# EAGLE design POE_PD_4_P-Schalter_minimized2 (EAGLE 6.5.0)
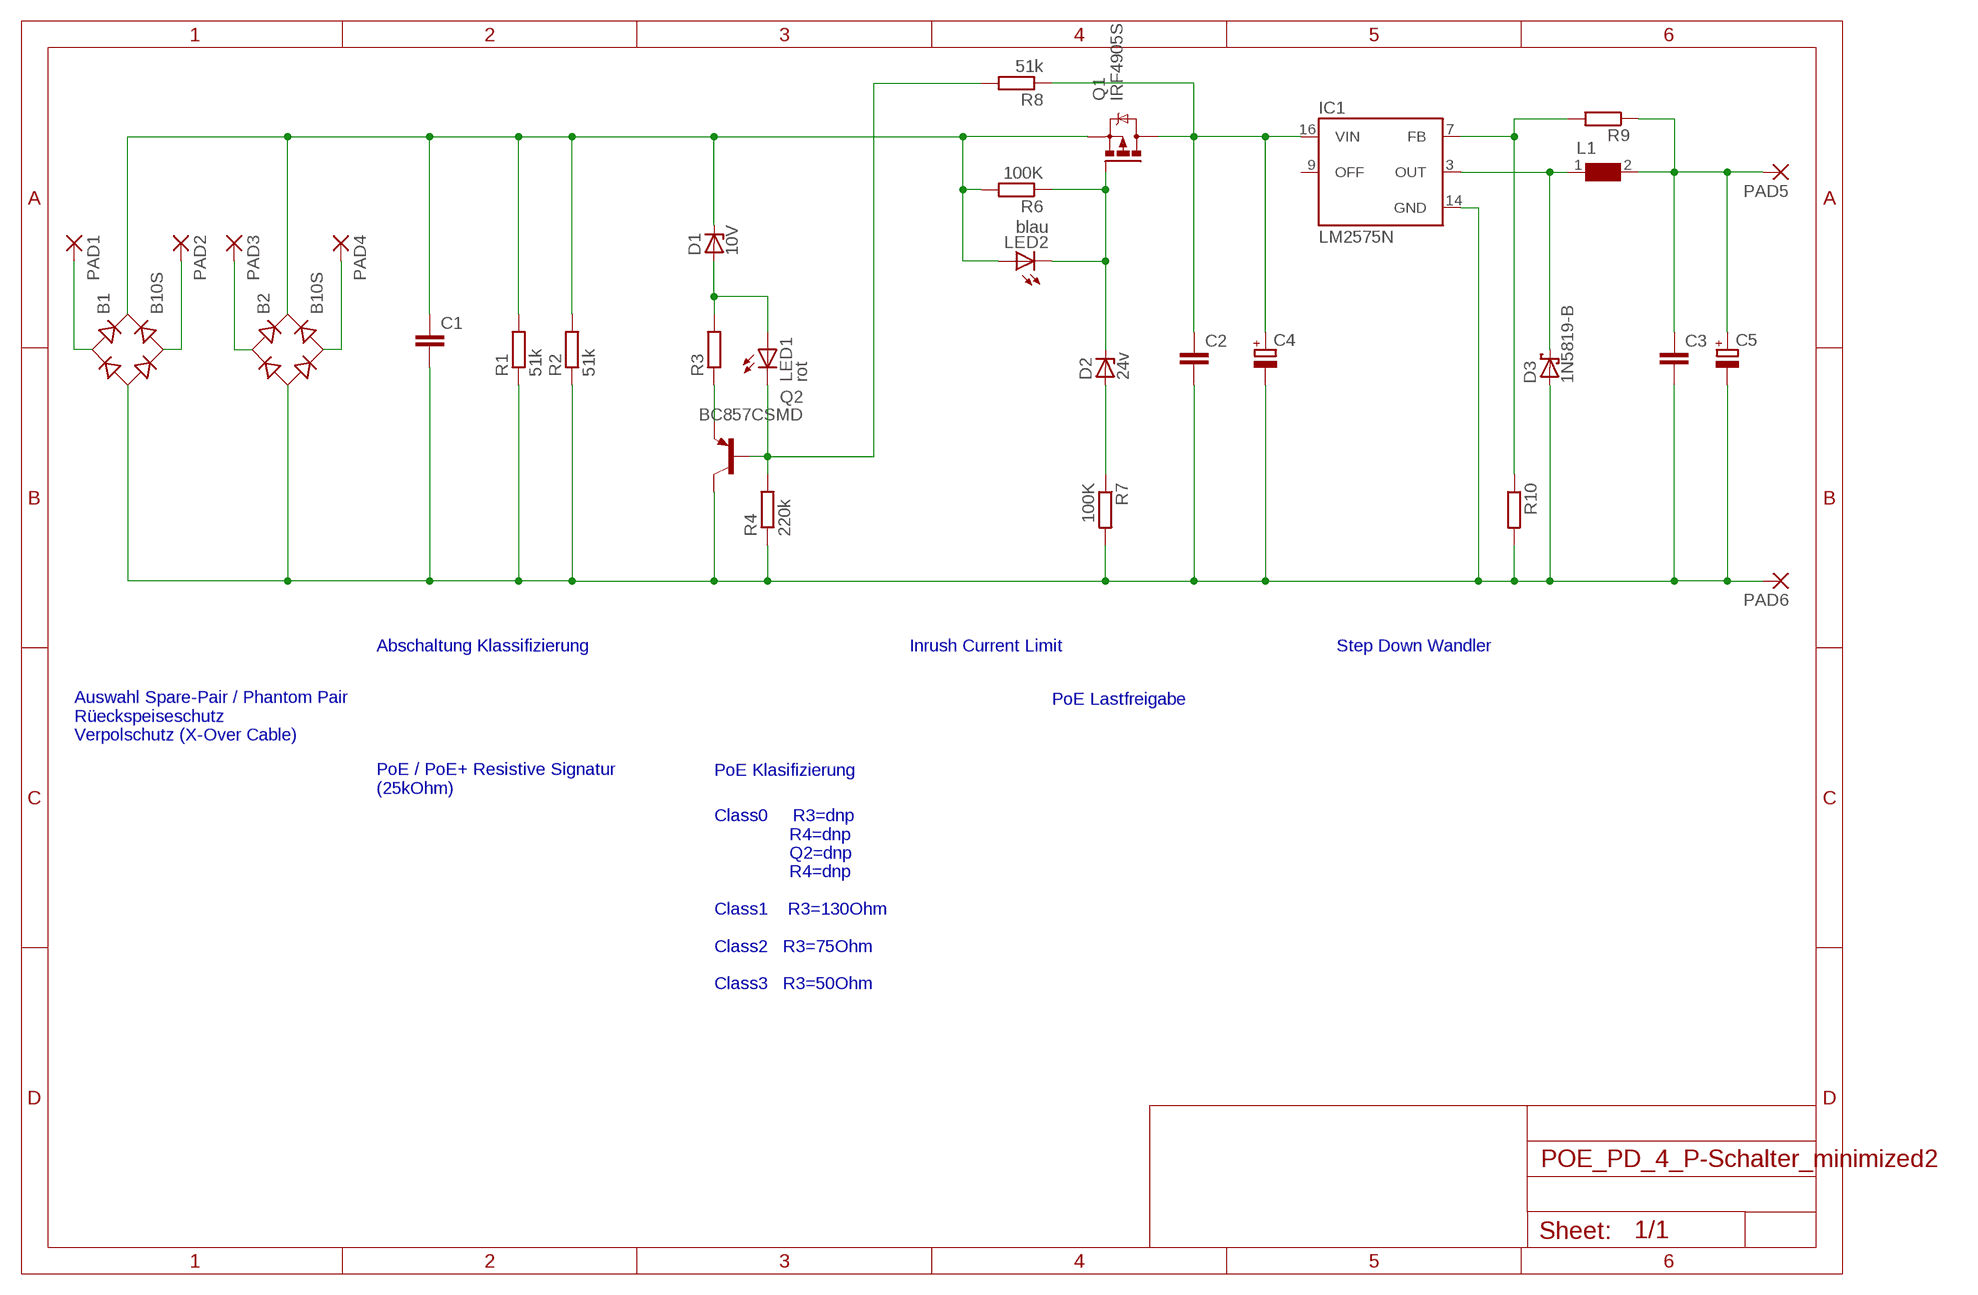
[diagram p0: schematic, sheet 1]

## Parts
B1  B10S  [MBS]
B2  B10S  [MBS]
C1  C-EUC0805  [C0805]
C2  C-EUC0805  [C0805]
C3  C-EUC0805  [C0805]
C4  CPOL-EUE2.5-5  [E2,5-5]
C5  CPOL-EUE2.5-5  [E2,5-5]
D1  10V  ZENER-DIODESOT23  [SOT23]
D2  24v  ZENER-DIODESOT23  [SOT23]
D3  1N5819-B  [DO41-7.6]
IC1  LM2575N  [DIL16]
L1  WE-PD2_S  [WE-PD2_S]
LED1  rot  LEDCHIP-LED0805  [CHIP-LED0805]
LED2  blau  LEDCHIP-LED0805  [CHIP-LED0805]
PAD1  2,15/1,0  [2,15/1,0]
PAD2  2,15/1,0  [2,15/1,0]
PAD3  2,15/1,0  [2,15/1,0]
PAD4  2,15/1,0  [2,15/1,0]
PAD5  2,15/1,0  [2,15/1,0]
PAD6  2,15/1,0  [2,15/1,0]
Q1  IRF4905S  IRFR5305  [D-PAK_TO252AA]
Q2  BC857CSMD  [SOT23-BEC]
R1  51k  R-EU_R0603  [R0603]
R2  51k  R-EU_R0603  [R0603]
R3  R-EU_0207/7  [0207/7]
R4  220k  R-EU_R0603  [R0603]
R6  100K  R-EU_R0603  [R0603]
R7  100K  R-EU_R0603  [R0603]
R8  51k  R-EU_R0603  [R0603]
R9  R-EU_0207/7  [0207/7]
R10  R-EU_0207/7  [0207/7]

## Nets
N$1: B1.- B2.- C1.2 C2.2 C3.2 C4.- C5.- D3.A IC1.14(GND) PAD6.1(P) Q2.C R1.1 R2.1 R4.1 R7.2 R10.2
N$4: Q2.E R3.1
N$5: B1.AC1 PAD1.1(P)
N$6: LED1.C Q2.B R4.2 R8.2
N$8: D1.1(A) LED1.A R3.2
N$9: D2.1(A) R7.1
N$10: B1.+ B2.+ C1.1 D1.3(C) LED2.A Q1.3(S) R1.2 R2.2 R6.2
N$11: D2.3(C) LED2.C Q1.1(G) R6.1
N$12: D3.C IC1.3(OUT) L1.1
N$13: C3.1 C5.+ L1.2 PAD5.1(P) R9.1
N$14: C2.1 C4.+ IC1.16(VIN) Q1.4(D) R8.1
N$15: IC1.7(FB) R9.2 R10.1
N$16: B1.AC2 PAD2.1(P)
N$17: B2.AC1 PAD3.1(P)
N$18: B2.AC2 PAD4.1(P)
Unconnected: IC1.9(OFF)

## Notes on the sheet
- Abschaltung Klassifizierung | Inrush Current Limit | Step Down Wandler
- PoE Lastfreigabe
- Auswahl Spare-Pair / Phantom Pair
  Rüeckspeiseschutz
  Verpolschutz (X-Over Cable)
- PoE Klasifizierung
- PoE / PoE+ Resistive Signatur
  (25kOhm)
- Class0     R3=dnp
                 R4=dnp
                 Q2=dnp
                 R4=dnp
  
  Class1    R3=130Ohm
  
  Class2   R3=75Ohm
  
  Class3   R3=50Ohm

## Library data of the parts
B1 B2 = rectifier:B*S: Surface Mount Glass Passivated Bridge Rectifiers Source: Comchip Bridge Rectifiers B05S-G_B10S-G.pdf
C1-C3 = rcl:C-EU: CAPACITOR, European symbol
C4 C5 = rcl:CPOL-EU: POLARIZED CAPACITOR, European symbol
D1 D2 = diode:ZENER-DIODE: Z-Diode
D3 = diode:1N581*: 1.0A SCHOTTKY BARRIER RECTIFIER Source: http://www.diodes.com/datasheets/ds23001.pdf
IC1 = v-reg-3:LM2575: National Semiconductor <http://www.national.com> 1.0A "Simple Switcher"(c) 52kHz, Vout 1.23-37V (HV: 57V), Vin 40V (HV: 60V), 50µA standby current
L1 = wuerth_elektronik_EAGLE:WE-PD2: SMD-Power Inductors WE-PD2 Is recommended for the application with switching regulators from National Semiconductor, Linear Technology, Texas Instruments and Fairchild Semiconductor -- Switching regulators with low operating voltages (computer, laptop, mobile phones, pagers) -- Integrated DC/DC-converter
LED1 LED2 = led:LED: LED OSRAM: - CHIPLED LG R971, LG N971, LY N971, LG Q971, LY Q971, LO R971, LY R971 LH N974, LH R974 LS Q976, LO Q976, LY Q976 LO Q996 - Hyper CHIPLED LW Q18S LB Q993, LB Q99A, LB R99A - SideLED LS A670, LO A670, LY A670, LG A670, LP A670 LB A673, LV A673, LT A673, LW A673 LH A674 LY A675 LS A676, LA A676, LO A676, LY A676, LW A676 LS A679, LY A679, LG A679 - Hyper Micro SIDELED® LS Y876, LA Y876, LO Y876, LY Y876 LT Y87S - SmartLED LW L88C, LW L88S LB L89C, LB L89S, LG L890 LS L89K, LO L89K, LY L89K LS L896, LA L896, LO L896, LY L896 - TOPLED LS T670, LO T670, LY T670, LG T670, LP T670 LSG T670, LSP T670, LSY T670, LOP T670, LYG T670 LG T671, LOG T671, LSG T671 LB T673, LV T673, LT T673, LW T673 LH T674 LS T676, LA T676, LO T676, LY T676, LB T676, LH T676, LSB T676, LW T676 LB T67C, LV T67C, LT T67C, LS T67K, LO T67K, LY T67K, LW E67C LS E67B, LA E67B, LO E67B, LY E67B, LB E67C, LV E67C, LT E67C LW T67C LS T679, LY T679, LG T679 LS T770, LO T770, LY T770, LG T770, LP T770 LB T773, LV T773, LT T773, LW T773 LH T774 LS E675, LA E675, LY E675, LS T675 LS T776, LA T776, LO T776, LY T776, LB T776 LHGB T686 LT T68C, LB T68C - Hyper Mini TOPLED® LB M676 - Mini TOPLED Santana® LG M470 LS M47K, LO M47K, LY M47K Source: http://www.osram.convergy.de LUXEON: - LUMILED® LXK2-PW12-R00, LXK2-PW12-S00, LXK2-PW14-U00, LXK2-PW14-V00 LXK2-PM12-R00, LXK2-PM12-S00, LXK2-PM14-U00 LXK2-PE12-Q00, LXK2-PE12-R00, LXK2-PE12-S00, LXK2-PE14-T00, LXK2-PE14-U00 LXK2-PB12-K00, LXK2-PB12-L00, LXK2-PB12-M00, LXK2-PB14-N00, LXK2-PB14-P00, LXK2-PB14-Q00 LXK2-PR12-L00, LXK2-PR12-M00, LXK2-PR14-Q00, LXK2-PR14-R00 LXK2-PD12-Q00, LXK2-PD12-R00, LXK2-PD12-S00 LXK2-PH12-R00, LXK2-PH12-S00 LXK2-PL12-P00, LXK2-PL12-Q00, LXK2-PL12-R00 Source: www.luxeon.com KINGBRIGHT: KA-3528ASYC Source: www.kingbright.com
PAD1-PAD6 = wirepad:2,15/1,0: THROUGH-HOLE PAD
Q1 = transistor-power:IRF?5305: HEXFET Power MOSFET Source: http://www.irf.com/product-info/datasheets/data/irfr5305pbf.pdf
Q2 = transistor-pnp:BC857*: PNP Transistror
R1-R4 R6-R10 = rcl:R-EU_: RESISTOR, European symbol

## Board
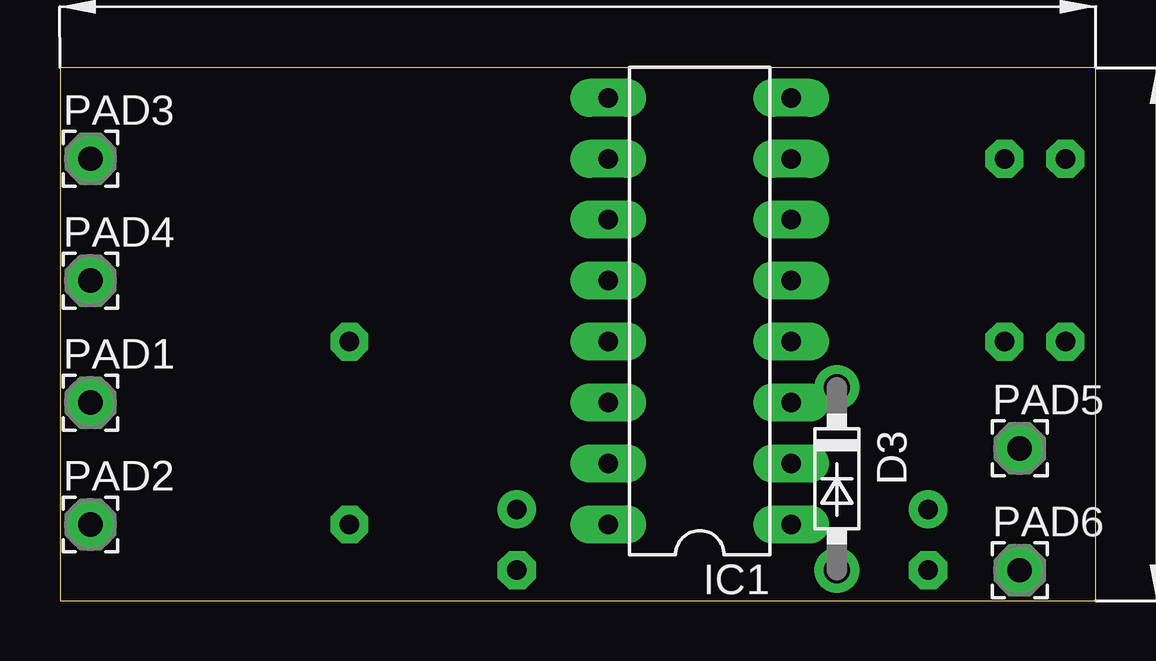
[diagram p1: board, top side]
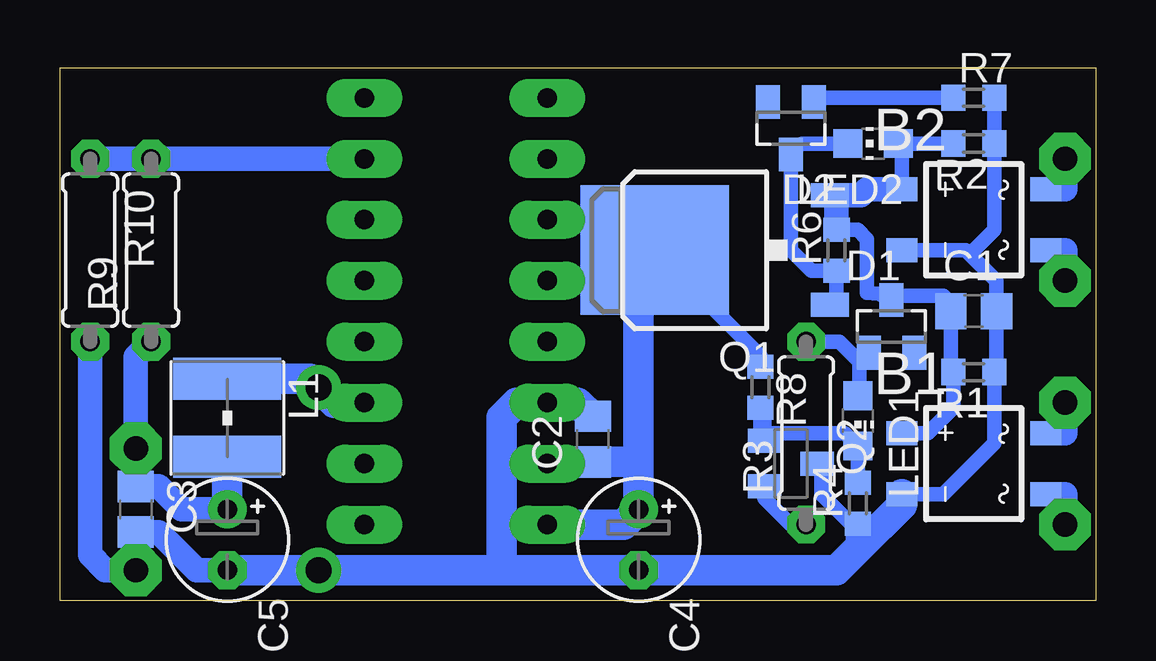
[diagram p2: board, bottom side, seen from below]

Size 43.17 x 22.21 mm. Coordinates in mm from the lower left corner, seen from the top.
Outline: 0,0 43.17,0 43.17,22.21 0,22.21 0,0
Copper layers (1*16): Top 0.035mm / dielectric 1.5mm / Bottom 0.035mm
Design rules "default *": minimum track width 10mil, minimum drill 0.6mm, track to track 8mil, track to pad 8mil, pad to pad 8mil, via to via 8mil, smd to smd 8mil, copper to edge 40mil, drill to drill 8mil, minimum pad ring 15mil, minimum via ring 8mil, stop-mask expansion 4mil, vias tented up to drill 0mil, thermal gap 10mil

### Footprints (pad centres in the part's own frame; a part is rotated, then mirrored left to right if it is on the bottom)
MBS = smd 1 x 1.3: + -1.27,-3; - 1.27,-3; AC1 -1.27,3; AC2 1.27,3
C0805 = smd 1.3 x 1.5: 1 -0.95,0; 2 0.95,0
E2,5-5 = drill 0.813 pad 1.6: + -1.27,0 | drill 0.813 pad 1.6 octagon: - 1.27,0
SOT23 = smd 1 x 1.4: 1 -0.95,-1.1; 2 0.95,-1.1; 3 0,1.1
DO41-7.6 = drill 1.1 pad 1.7: A 3.81,0; C -3.81,0
DIL16 = drill 0.813 long: 1 -8.89,-3.81; 2 -6.35,-3.81; 3 -3.81,-3.81; 4 -1.27,-3.81; 5 1.27,-3.81; 6 3.81,-3.81; 7 6.35,-3.81; 8 8.89,-3.81; 9 8.89,3.81; 10 6.35,3.81; 11 3.81,3.81; 12 1.27,3.81; 13 -1.27,3.81; 14 -3.81,3.81; 15 -6.35,3.81; 16 -8.89,3.81
WE-PD2_S = smd 1.75 x 4.5: 1 -1.625,0; 2 1.625,0
CHIP-LED0805 = smd 1.2 x 1.2: A 0,-1.05; C 0,1.05
2,15/1,0 = drill 1.016 pad 2.159 octagon: 1 0,0
D-PAK_TO252AA = smd 1 x 1.6: 1 -2.28,-4.8; 3 2.28,-4.8 | smd 5.4 x 6.2: 4 0,2.5
SOT23-BEC = smd 1 x 1.4: B -0.95,-1.1; C 0,1.1; E 0.95,-1.1
R0603 = smd 1 x 1.1: 1 -0.85,0; 2 0.85,0
0207/7 = drill 0.813 octagon: 1 -3.81,0; 2 3.81,0

### Placement (x,y rotation side)
B1  5.08,5.71 270 bottom
B2  5.08,15.88 270 bottom
C1  5.08,12.06 0 bottom
C2  20.95,6.73 90 bottom
C3  40.01,3.81 270 bottom
C4  19.05,2.54 270 bottom
C5  36.2,2.54 270 bottom
D1  8.51,11.43 0 bottom
D2  12.7,19.68 180 bottom
D3  32.38,5.08 270 top
IC1  26.67,12.06 90 top
L1  36.2,7.62 270 bottom
LED1  9.91,7.49 180 bottom
LED2  9.27,19.05 90 bottom
PAD1  1.27,8.26 0 top
PAD2  1.27,3.17 0 top
PAD3  1.27,18.41 0 top
PAD4  1.27,13.33 0 top
PAD5  40.01,6.35 0 top
PAD6  40.01,1.27 0 top
Q1  15.88,14.61 90 bottom
Q2  12.7,5.71 270 bottom
R1  5.08,9.53 180 bottom
R2  5.08,19.05 180 bottom
R3  12.06,6.98 90 bottom
R4  9.91,4.06 90 bottom
R6  10.79,14.61 90 bottom
R7  5.08,20.95 0 bottom
R8  13.97,8.89 270 bottom
R9  39.37,14.61 90 bottom
R10  41.91,14.61 270 bottom

### Tracks (layer width: path | path; a pad name or v marks a point on that pad's centre or on a via)
N$1
  Bottom 0.406: R1.1 4.13,9.62 | R4.1 10.2,3.21 | 11.43,5.54 Q2.C
  Bottom 0.61: B1.- 6.35,4.45 4.23,6.56 R1.1 | 4.13,9.62 C1.2 4.13,13.33 5.24,14.45 | B2.- 5.4,14.61 5.24,14.45 | 5.24,14.45 4.23,15.46 R2.1 R7.2 | 11.43,5.54 11.43,4.45 10.2,3.21
  Bottom 1.016: R4.1 9.91,2.16 | C5.- 37.47,1.27 39.05,2.86 C3.2 PAD6.1 41.27,1.27 41.91,1.91 R10.2
  Bottom 1.27: C2.2 21.02,7.68 21.59,8.26 IC1.14 24.13,8.26 24.77,7.62 24.77,1.27 | B1.- 8.08,3.98 9.91,2.16 10.79,1.27 C4.- 24.77,1.27 | C5.- D3.A 24.77,1.27
N$4
  Bottom 0.61: Q2.E 13.8,4.28 12.7,3.17 R3.1
N$5
  Bottom 1.016: B1.AC1 1.27,6.98 PAD1.1
N$6
  Bottom 0.61: R8.2 13.97,6.98 | 13.97,6.98 13.97,6.84 Q2.B 13.8,7.45 13.97,6.98 | 13.97,6.98 10.45,6.98 LED1.C R4.2
N$8
  Bottom 0.406: LED1.A 9.84,8.99
  Bottom 0.61: 9.84,8.99 9.84,9.95 | 9.84,9.95 D1.1 | R3.2 10.69,10.79 9.84,9.95
N$9
  Bottom 0.406: 11.75,20.95 D2.1
  Bottom 0.61: R7.1 11.75,20.95
N$10
  Bottom 0.406: 5.93,9.13 R1.2 6.03,9.62 | C1.1 6.03,12.38 | 8.76,12.7 8.83,12.76 8.89,12.7 | 8.08,18.91 LED2.A
  Bottom 0.61: 6.03,9.62 C1.1 | B1.+ 6.99,6.98 5.93,8.04 R1.2 | 6.03,12.38 6.35,12.7 8.76,12.7 | 8.83,12.76 9.53,12.83 9.53,15.06 9.91,15.46 R6.2 | D1.3 8.89,12.7 | R2.2 LED2.A | B2.+ 8.08,18.91
  Bottom 1.016: B2.+ 9.53,17.14 9.79,16.89 Q1.3 10.79,16.61 R6.2
N$11
  Bottom 0.406: 10.79,12.61 Q1.1 | 12.23,19.05 D2.3
  Bottom 0.61: 10.79,12.61 R6.1 11.85,13.75 12.7,14.61 D2.3 | LED2.C 12.23,19.05
N$12
  Bottom 1.27: IC1.3 31.75,8.26 D3.C 32.74,9.24 L1.1
N$13
  Bottom 1.016: C5.+ 38.1,3.81 39.05,4.76 C3.1 PAD5.1 40.01,10.16 R9.1
  Bottom 1.27: L1.2 C5.+
N$14
  Bottom 0.61: R8.1 13.97,10.2 Q1.4
  Bottom 1.27: 19.05,5.71 C4.+ 19.68,3.17 IC1.16 | 19.05,5.71 19.05,13.93 Q1.4 | C2.1 19.12,5.78 19.05,5.71
N$15
  Bottom 1.016: R10.1 R9.2 IC1.7
N$16
  Bottom 1.016: B1.AC2 1.27,4.45 PAD2.1
N$17
  Bottom 1.016: B2.AC1 1.27,17.14 PAD3.1
N$18
  Bottom 1.016: B2.AC2 1.27,14.61 PAD4.1